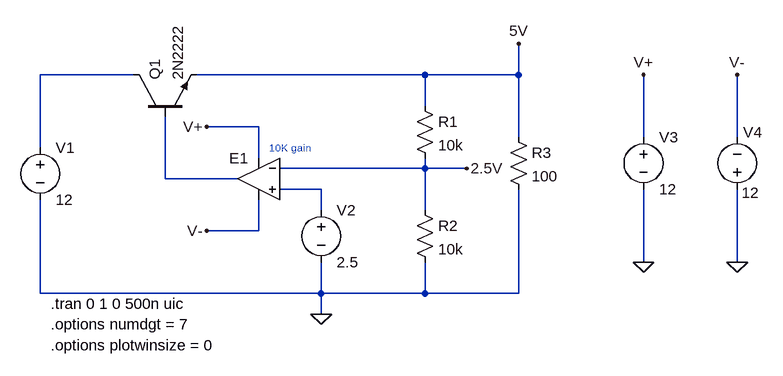
[diagram p0: schematic LDO.asc]
LDO.asc, the LTspice schematic file:
Version 4
SHEET 1 1176 680
WIRE 192 32 48 32
WIRE 640 32 288 32
WIRE 784 32 784 -16
WIRE 784 32 640 32
WIRE 640 80 640 32
WIRE 384 112 304 112
WIRE 784 128 784 32
WIRE 976 128 976 32
WIRE 1120 128 1120 32
WIRE 48 144 48 32
WIRE 384 160 384 112
WIRE 640 176 640 160
WIRE 640 176 416 176
WIRE 704 176 640 176
WIRE 240 192 240 96
WIRE 352 192 240 192
WIRE 480 208 416 208
WIRE 480 240 480 208
WIRE 640 240 640 176
WIRE 384 272 384 224
WIRE 384 272 304 272
WIRE 976 320 976 208
WIRE 1120 320 1120 208
WIRE 48 368 48 224
WIRE 480 368 480 320
WIRE 480 368 48 368
WIRE 640 368 640 320
WIRE 640 368 480 368
WIRE 784 368 784 208
WIRE 784 368 640 368
WIRE 480 400 480 368
FLAG 304 112 V+
FLAG 304 272 V-
FLAG 976 320 0
FLAG 1120 320 0
FLAG 976 32 V+
FLAG 1120 32 V-
FLAG 480 400 0
FLAG 784 -16 5V
FLAG 704 176 2.5V
SYMBOL voltage 48 128 R0
WINDOW 123 0 0 Left 0
WINDOW 39 0 0 Left 0
SYMATTR InstName V1
SYMATTR Value 12
SYMBOL npn 192 96 R270
SYMATTR InstName Q1
SYMATTR Value 2N2222
SYMBOL voltage 480 224 R0
WINDOW 123 0 0 Left 0
WINDOW 39 0 0 Left 0
SYMATTR InstName V2
SYMATTR Value 2.5
SYMBOL res 624 64 R0
SYMATTR InstName R1
SYMATTR Value 10k
SYMBOL res 624 224 R0
SYMATTR InstName R2
SYMATTR Value 10k
SYMBOL res 768 112 R0
SYMATTR InstName R3
SYMATTR Value 100
SYMBOL voltage 976 112 R0
SYMATTR InstName V3
SYMATTR Value 12
SYMBOL voltage 1120 224 R180
WINDOW 123 0 0 Left 0
WINDOW 39 0 0 Left 0
WINDOW 0 -39 104 Left 2
WINDOW 3 -34 11 Left 2
SYMATTR InstName V4
SYMATTR Value 12
SYMBOL OpAmps\\UniversalOpAmp1 384 192 M0
SYMATTR InstName E1
SYMATTR Value2 Avol=10k GBW=10Meg Vos=0
TEXT 64 384 Left 2 !.tran 0 1 0 500n uic
TEXT 400 144 Left 1 ;10K gain
TEXT 64 416 Left 2 !.options numdgt = 7
TEXT 64 448 Left 2 !.options plotwinsize = 0

The netlist it stands for:
* LDO.asc
V1 N001 0 12
Q1 N001 N002 5V 0 2N2222
V2 N003 0 2.5
R1 5V 2.5V 10k
R2 2.5V 0 10k
R3 5V 0 100
V3 V+ 0 12
V4 0 V- 12
XE1 N003 2.5V V+ V- N002 level1 Avol=10k GBW=10Meg Vos=0 En=0 Enk=0 In=0 Ink=0 Rin=500Meg  ; pins In+ In- V+ V- OUT
.model NPN NPN
.model PNP PNP
.lib standard.bjt
.tran 0 1 0 500n uic
* 10K gain
.options numdgt = 7
.options plotwinsize = 0
.lib UniversalOpAmp1.lib
.backanno
.end